# Altium schematic sheet [15]-CLOCK.SchDoc
size A4
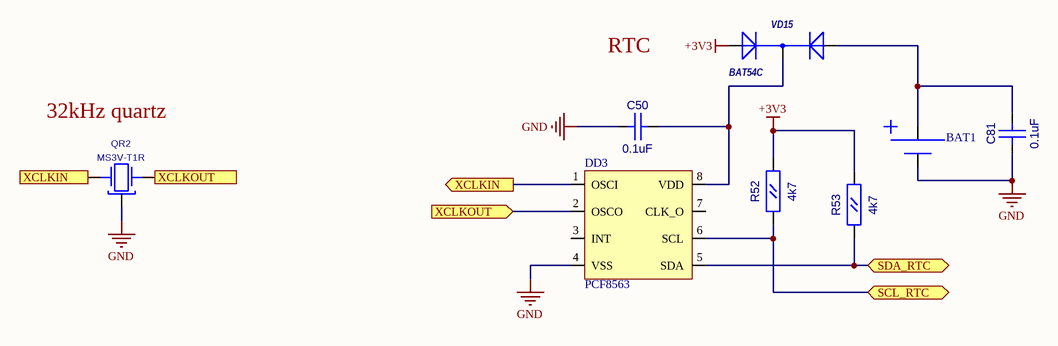
[diagram p0: [15]-CLOCK.SchDoc]

## Parts
BAT1  CR2032-VBY4  [CR2032_ONBOARD]  (value not drawn)
C50  0.1uF  [CC0603]
C81  0.1uF  [CC0603]
DD3  PCF8563  [SO-8]
QR2  MS3V-T1R  [MS3V-T1R]
R52  4k7  [RC0603]
R53  4k7  [RC0603]
VD15  BAT54C  [SOT-23(123)]

## Ports
SCL_RTC (bidir), SDA_RTC (bidir), XCLKIN (in), XCLKIN (out), XCLKOUT (in), XCLKOUT (out)

## Nets
+3V3: R52.2(B) R53.2(B) VD15.1(A)
GND: BAT1.1 C50.1(A) C81.1(A) DD3.4(VSS) QR2.3
SCL_RTC: DD3.6(SCL) R52.1(A) ; port SCL_RTC
SDA_RTC: DD3.5(SDA) R53.1(A) ; port SDA_RTC
XCLKIN: DD3.1(OSCI) QR2.2(X2) ; port XCLKIN
XCLKOUT: DD3.2(OSCO) QR2.1(X1) ; port XCLKOUT
NetBAT1_2: BAT1.2 C81.2(B) VD15.2(A)
NetC50_2: C50.2(B) DD3.8(VDD) VD15.3(K)

Not connected (* = marked no-connect by the designer): DD3 3(INT) 7(CLK_O)

## Notes on the sheet
- RTC
- (near QR2) 32kHz quartz

## Library data of the parts
BAT1 = CR2032-VBY2: Value: CR2032-VBY4
C50 C81 = CC0603: Value: 0.1uF
QR2 = MS3V-T1R: CRYSTAL_32768 Hz; Value: MS3V-T1R
R52 R53 = RC0603: Value: 4k7
DD3 = PCF8563: Value: PCF8563
VD15 = BAT54C: Value: *